# Altium schematic sheet QUDONG.SchDoc
size A3
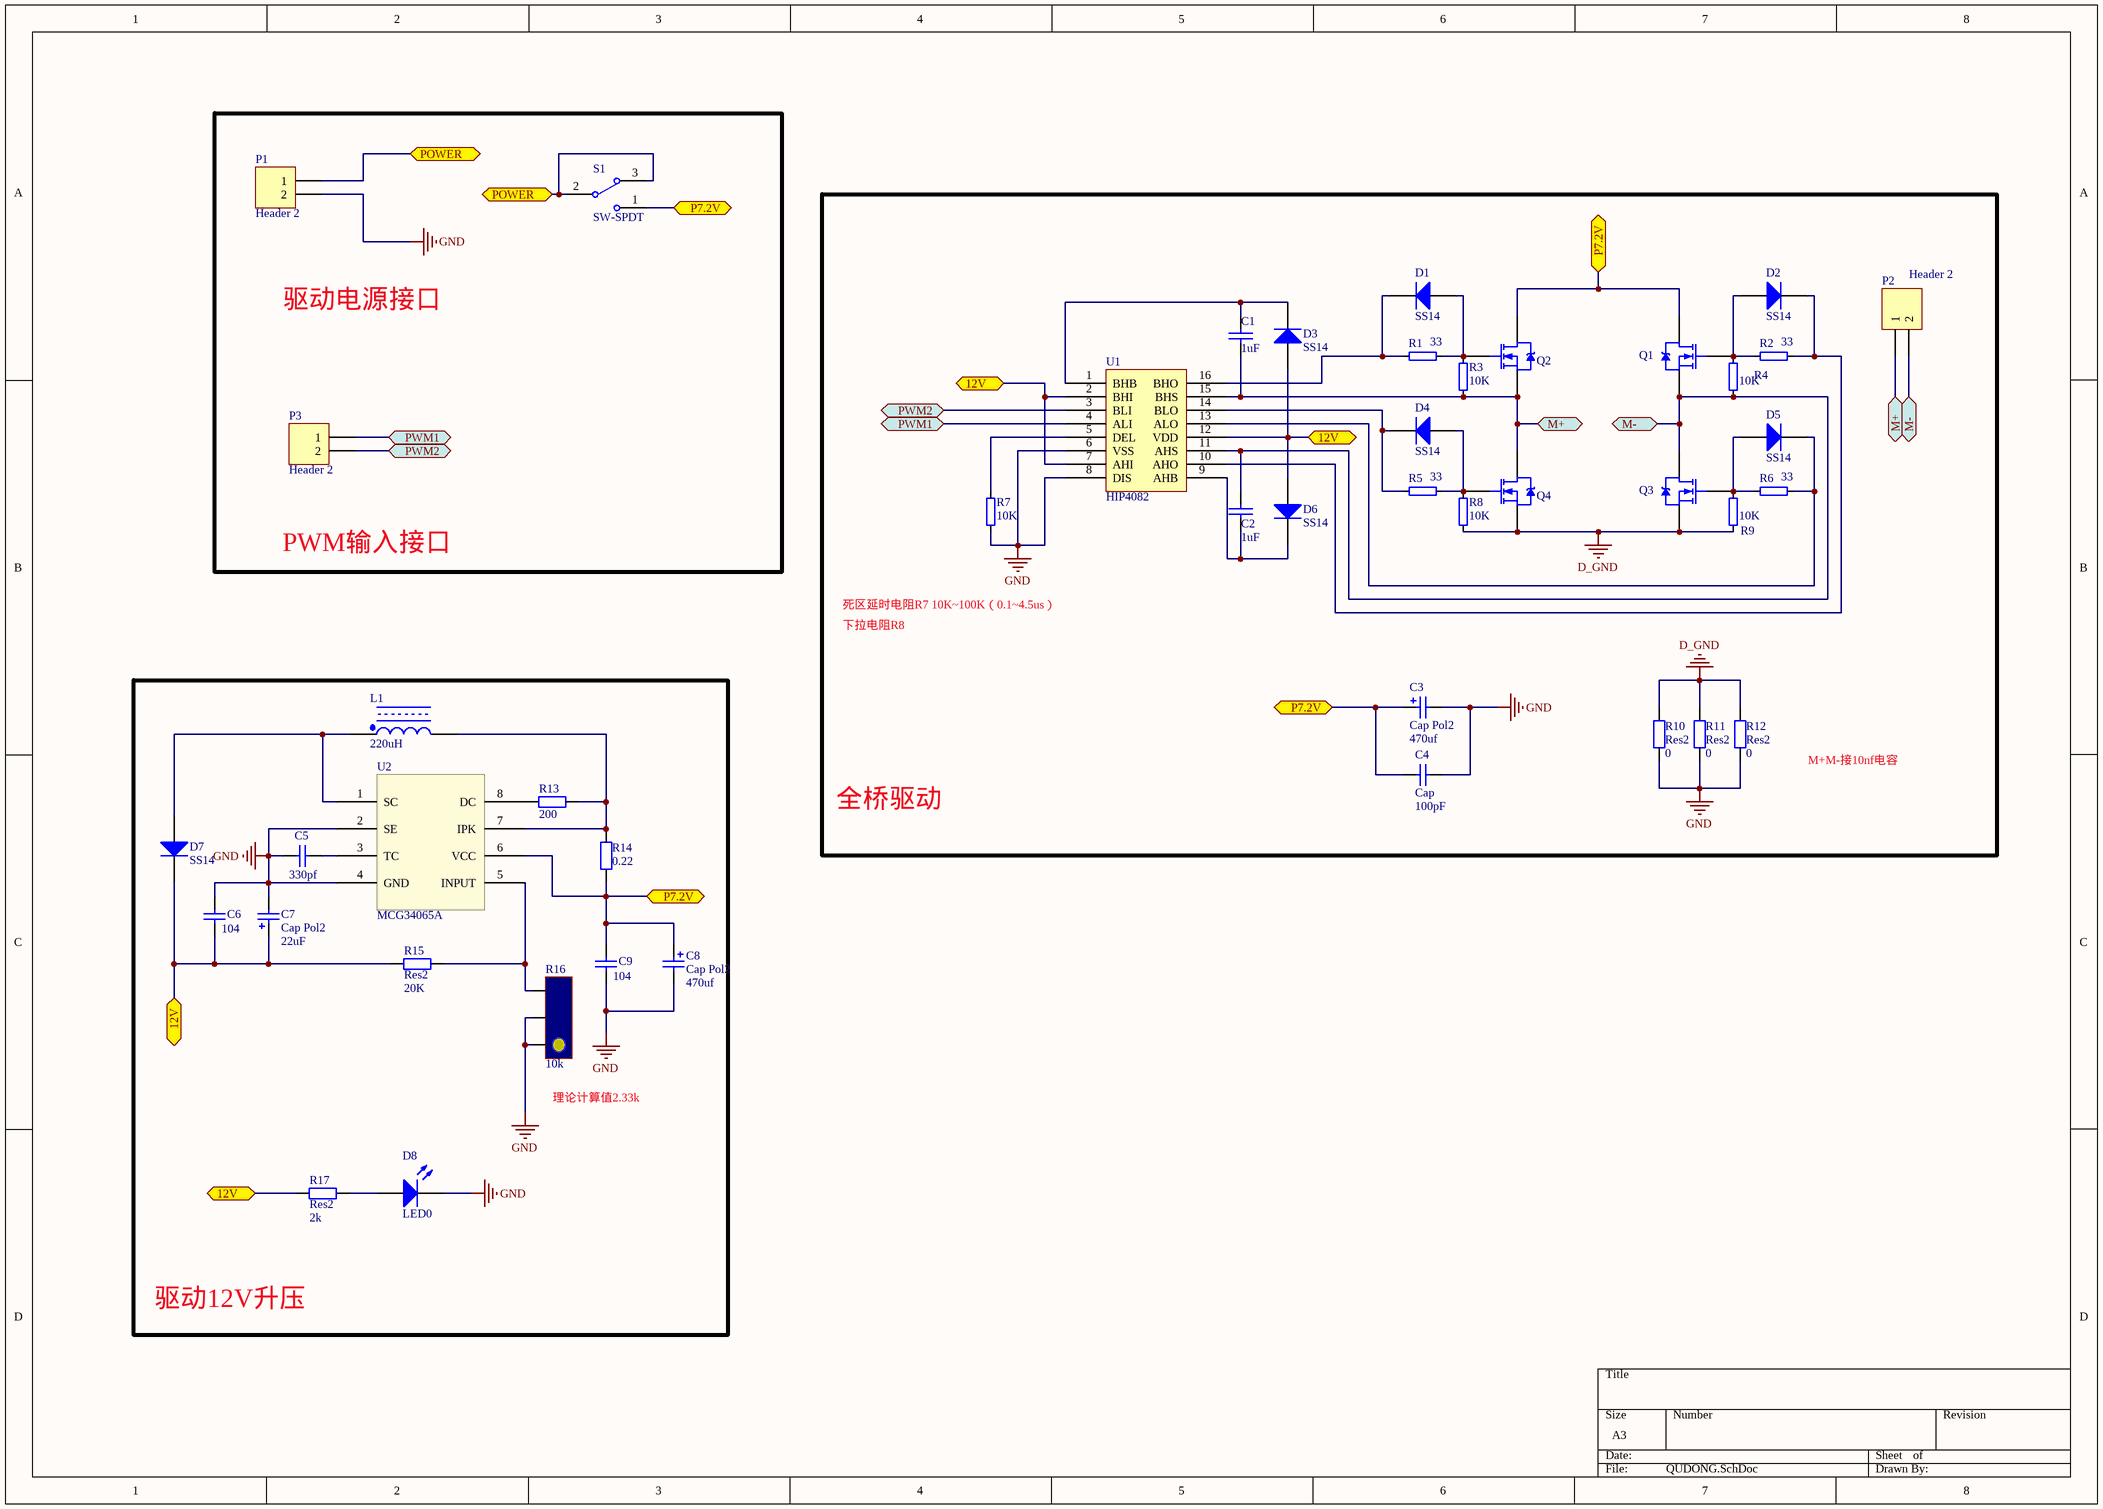
[diagram p0: QUDONG.SchDoc]

## Parts
C1  1uF  [C-0805]
C2  1uF  [C-0805]
C3  Cap Pol2  value 470uf  [CAP-E1]
C4  Cap  value 100pF  [C-0805]
C5  value 330pf  [C-0805]  (hidden comment: Cap)
C6  value 104  [C-0805]  (hidden comment: Cap)
C7  Cap Pol2  value 22uF  [1206]
C8  Cap Pol2  value 470uf  [CAP-E1]
C9  value 104  [C-0805]  (hidden comment: Cap)
D1  SS14  [SOT-123]
D2  SS14  [SOT-123]
D3  SS14  [DO214AA]
D4  SS14  [SOT-123]
D5  SS14  [SOT-123]
D6  SS14  [DO214AA]
D7  SS14  [DO214AA]
D8  LED0  [6-0805_N]
L1  220uH  [L-SMD-7]
P1  Header 2  [T型插头(公)]
P2  Header 2  [接线柱]
P3  Header 2  [2PIN-弯]
Q1  IRF3205  [TO-252AA_M]  (value not drawn)
Q2  IRF3205  [TO-252AA_M]  (value not drawn)
Q3  IRF3205  [TO-252AA_M]  (value not drawn)
Q4  IRF3205  [TO-252AA_M]  (value not drawn)
R1  33  [0805]
R2  33  [0805]
R3  10K  [0805]
R4  10K  [0805]
R5  33  [0805]
R6  33  [0805]
R7  10K  [0805]
R8  10K  [0805]
R9  10K  [0805]
R10  Res2  value 0  [0805]
R11  Res2  value 0  [0805]
R12  Res2  value 0  [0805]
R13  value 200  [0805]  (hidden comment: Res2)
R14  value 0.22  [0805]  (hidden comment: Res2)
R15  Res2  value 20K  [0805]
R16  value 10k  [T-3224w]  (hidden comment: RES-ADJ)
R17  Res2  value 2k  [0805]
S1  SW-SPDT  [SWITCH_B]
U1  HIP4082  [SO-16N]
U2  MCG34065A  [SO-8]

## Blocks framed on the sheet
全桥驱动: C1-C4 D1-D6 P2 Q1-Q4 R1-R12 U1
驱动12V升压: C5-C9 D7 D8 L1 R13-R17 U2

## Ports
12V, M+, M-, P7.2V, POWER, PWM1, PWM2

## Nets
D_GND: Q3.3(S) Q4.3(S) R8.1 R9.1 R10.2 R11.2 R12.2
GND: C3.2 C4.1 C5.2 C6.1 C7.2 C8.2 C9.2 D8.2(K) P1.2 R7.2 R10.1 R11.1 R12.1 R16.2 R16.3 U1.6(VSS) U1.8(DIS) U2.2(SE) U2.4(GND)
12V: C6.2 C7.1 D3.1(A) D6.1(A) D7.2(K) R15.2 R17.1 U1.2(BHI) U1.7(AHI) U1.12(VDD) ; port 12V
M+: C1.1 P2.1 Q2.3(S) Q4.4(D) R3.1 U1.15(BHS) ; port M+
M-: C2.2 P2.2 Q1.3(S) Q3.4(D) R4.1 U1.11(AHS) ; port M-
P7.2V: C3.1 C4.2 C8.1 C9.1 Q1.4(D) Q2.4(D) R14.2 S1.1 U2.6(VCC) ; port P7.2V
POWER: P1.1 S1.2 S1.3 ; port POWER
PWM1: P3.1 U1.4(ALI) ; port PWM1
PWM2: P3.2 U1.3(BLI) ; port PWM2
NetC1_2: C1.2 D3.2(K) U1.1(BHB)
NetC2_1: C2.1 D6.2(K) U1.9(AHB)
NetC5_1: C5.1 U2.3(TC)
NetD1_1: D1.1(A) Q2.1(G) R1.2 R3.2
NetD1_2: D1.2(K) R1.1 U1.16(BHO)
NetD2_1: D2.1(A) Q1.1(G) R2.1 R4.2
NetD2_2: D2.2(K) R2.2 U1.10(AHO)
NetD4_1: D4.1(A) Q4.1(G) R5.2 R8.2
NetD4_2: D4.2(K) R5.1 U1.14(BLO)
NetD5_1: D5.1(A) Q3.1(G) R6.1 R9.2
NetD5_2: D5.2(K) R6.2 U1.13(ALO)
NetD7_1: D7.1(A) L1.1 U2.1(SC)
NetD8_1: D8.1(A) R17.2
NetL1_2: L1.2 R13.1 R14.1 U2.7(IPK)
NetR7_1: R7.1 U1.5(DEL)
NetR13_2: R13.2 U2.8(DC)
NetR15_1: R15.1 R16.1 U2.5(INPUT)

## Notes on the sheet
- 驱动电源接口
- PWM输入接口
- 死区延时电阻R7 10K~100K（0.1~4.5us）
- 下拉电阻R8
- M+M-接10nf电容
- (near R16) 理论计算值2.33k

## Library data of the parts
C1 C2 = CAP: Capacitor
C3 C7 C8 = Cap Pol2: Polarized Capacitor (Axial); Published: 8-Jun-2000; LatestRevisionDate: 17-Jul-2002; LatestRevisionNote: Re-released for DXP Platform.; PackageReference: POLAR0.8; Publisher: Altium Limited; PackageDescription: Polarized Capacitor; 2 Leads
C4-C6 C9 = Cap: Capacitor; Published: 8-Jun-2000; LatestRevisionDate: 17-Jul-2002; LatestRevisionNote: Re-released for DXP Platform.; PackageReference: RAD-0.3; Publisher: Altium Limited; PackageDescription: Radial Cap, Thru-Hole; 2 Leads; 0.3 in Pin Spacing
D1-D6 = Diode 1N4148: High Conductance Fast Diode; Published: 8-Jun-2000; LatestRevisionDate: 17-Jul-2002; LatestRevisionNote: Re-released for DXP Platform.; DatasheetVersion: 1997; PackageReference: DO-35; Publisher: Altium Limited; PackageDescription: Diode, Axial; Body 3.8 x 1.9 mm (LxDia. max), Lead Dia. 0.53 mm (max); Code_JEDEC: DO-204-AH; ComponentLink1Description: Manufacturer Link; ComponentLink1URL: http://www.fairchildsemi.com/; ComponentLink2Description: Datasheet; ComponentLink2URL: http://www.fairchildsemi.com/ds/1N%2F1N4148.pdf
D7 = Diode: Default Diode; Published: 8-Jun-2000; LatestRevisionDate: 17-Jul-2002; LatestRevisionNote: Re-released for DXP Platform.; PackageVersion: Sep-1996; PackageReference: SMC; Publisher: Altium Limited; PackageDescription: DO-214-AB/SMC; 2 C-Bend Leads; Body 7.9 x 5.9 mm, inc. leads (LxW); Code_JEDEC: DO-214-AB
D8 = LED0: Typical INFRARED GaAs LED; Published: 8-Jun-2000; LatestRevisionDate: 08-Jul-2005; LatestRevisionNote: Mech Layer 1 removed.; PackageReference: LED-0; Publisher: Altium Limited; PackageDescription: LED; 2 Leads
L1 = L-D-SMD: 磁芯电感; BOM名称: 磁芯电感
P1-P3 = Header 2: Header, 2-Pin; LatestRevisionDate: 17-Jul-2002; LatestRevisionNote: Re-released for DXP Platform.; Publisher: Altium Limited
Q1-Q4 = IRLR7843
R1-R9 = RES
R10-R15 R17 = Res2: Resistor; Published: 8-Jun-2000; LatestRevisionDate: 17-Jul-2002; LatestRevisionNote: Re-released for DXP Platform.; PackageReference: AXIAL-0.4; Publisher: Altium Limited; PackageDescription: Axial Device, Thru-Hole; 2 Leads; 0.4 in Pin Spacing
S1 = SW-SPDT: SPDT Subminiature Toggle Switch, Right Angle Mounting, Vertical Actuation; Published: 24-Mar-1999; LatestRevisionDate: 17-Dec-2003; LatestRevisionNote: Schematic revised, PCB Footprint replaced.; DatasheetVersion: 05-Dec-2000; PackageReference: TL36WW15050; Publisher: Altium Limited; PackageDescription: Switch; 4 Leads; ComponentLink1Description: Manufacturer Link; ComponentLink1URL: http://www.apem.com